# EAGLE schematic Type-C Test Fixture (TPS65987D)_v1 (EAGLE 9.6.1)
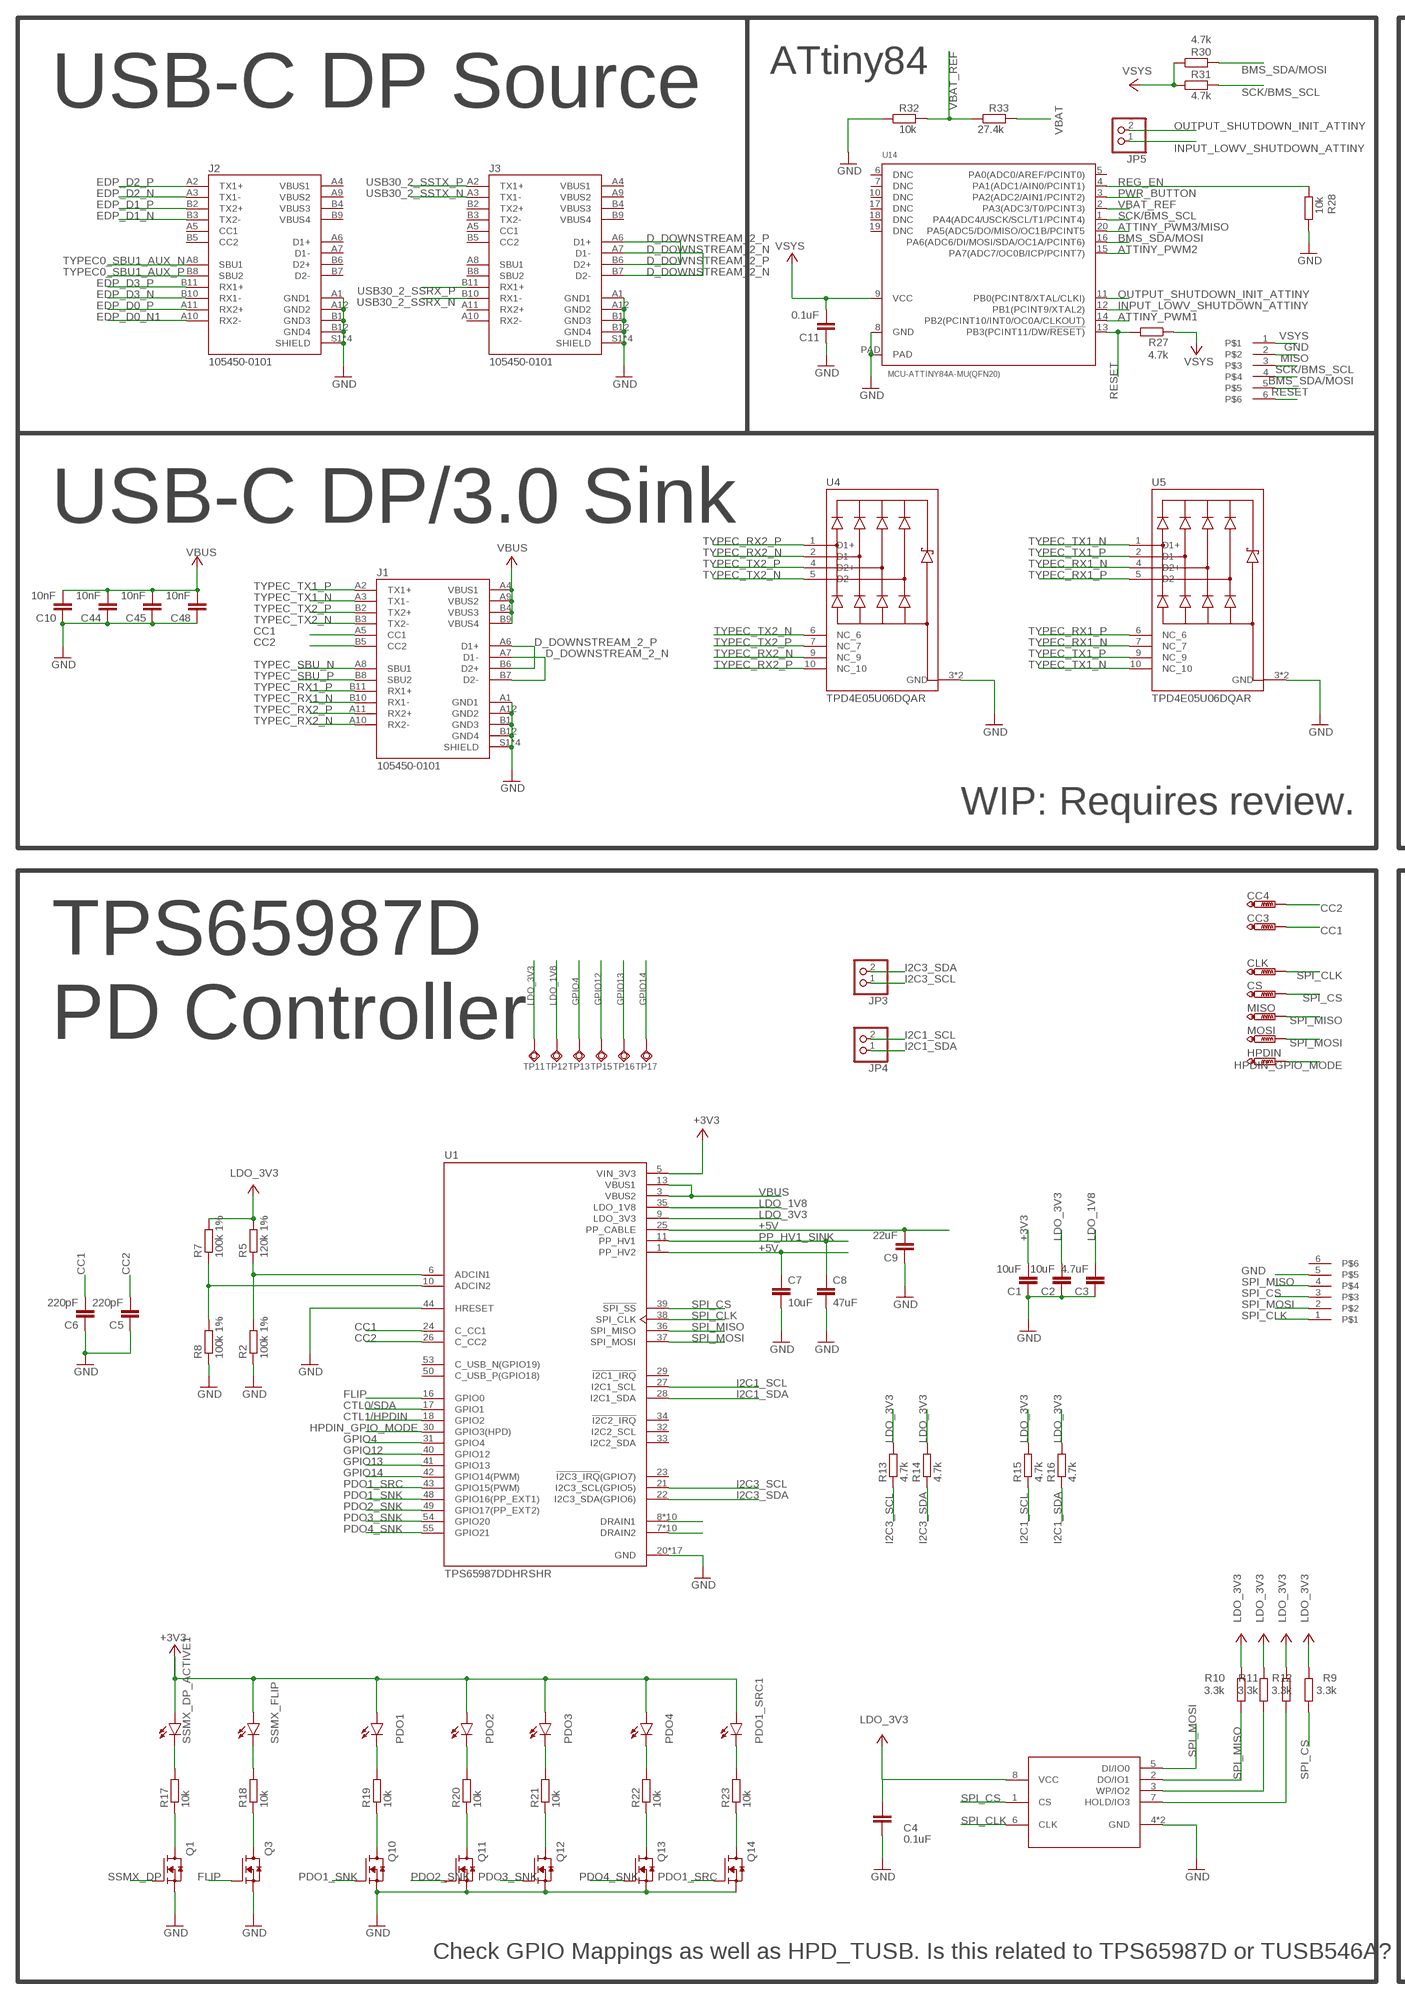
[diagram p0: schematic, sheet 1, part 1 of 2]
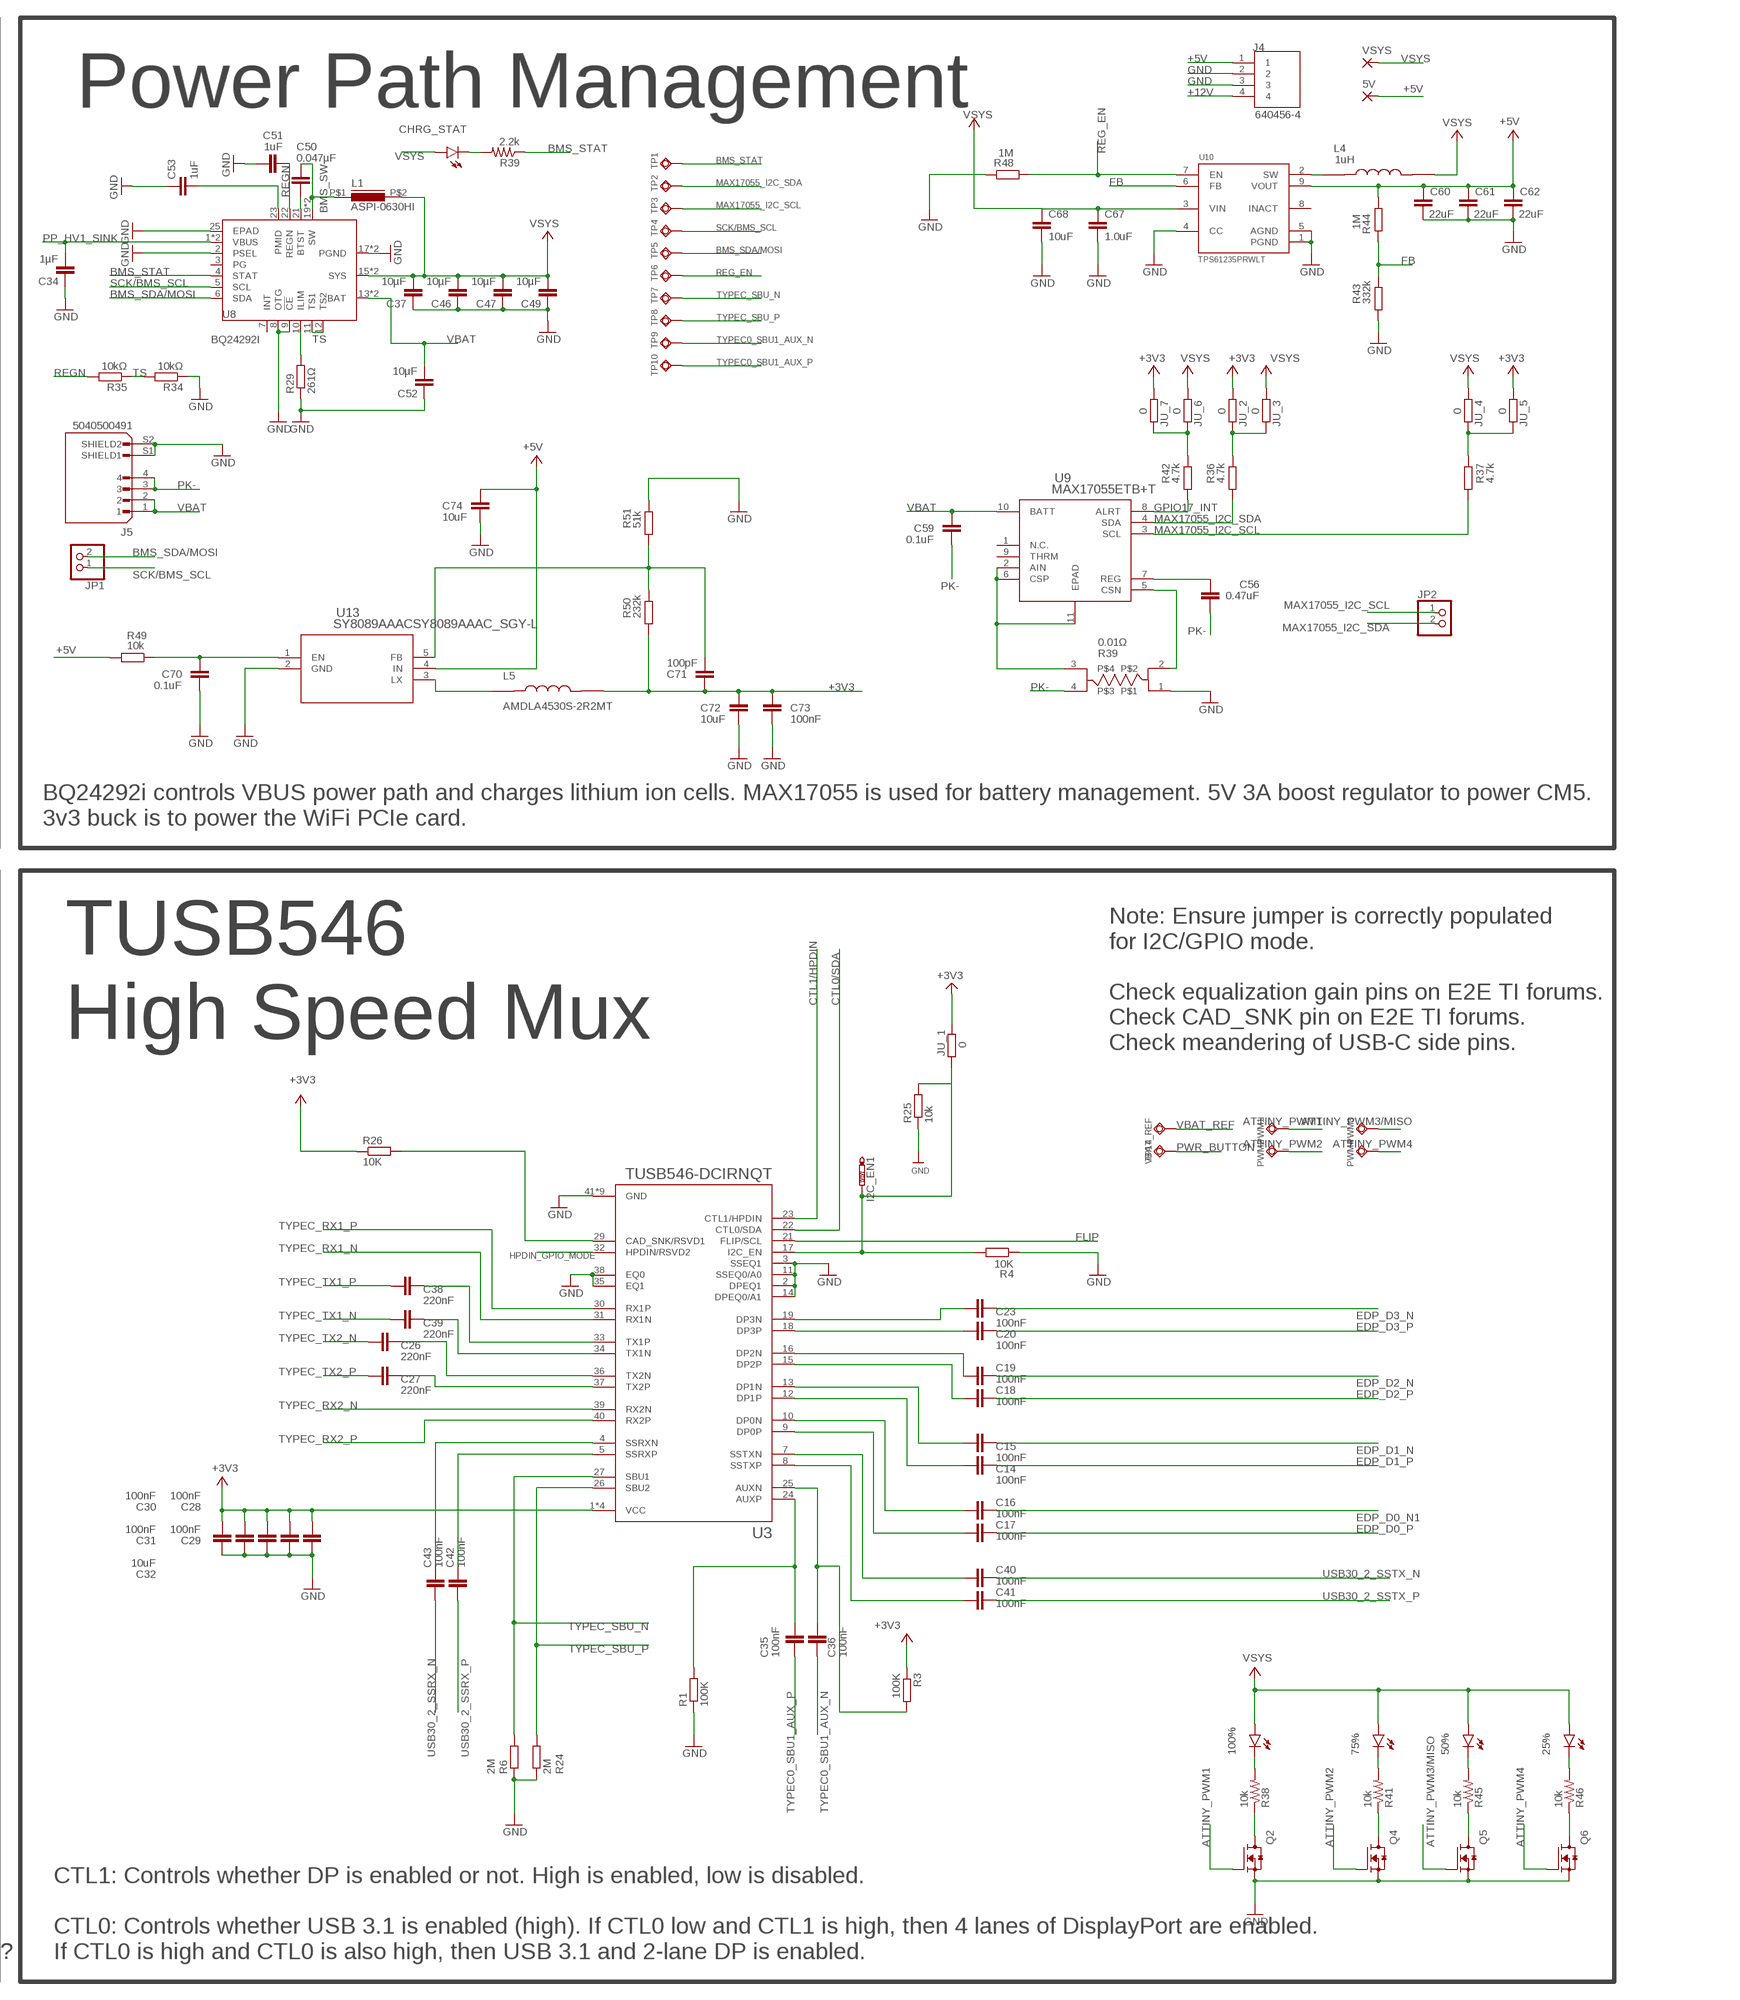
[diagram p1: schematic, sheet 1, part 2 of 2]

## Parts
5V  SMD5  [SMD2,54-5,08]
25%  LEDSML0603  [SML0603]
50%  LEDSML0603  [SML0603]
75%  LEDSML0603  [SML0603]
100%  LEDSML0603  [SML0603]
C1  10uF  C-EUC0402  [C0402]
C2  10uF  C-EUC0402  [C0402]
C3  4.7uF  C-EUC0402  [C0402]
C4  0.1uF  C-EUC0402  [C0402]
C5  220pF  C-EUC0402  [C0402]
C6  220pF  C-EUC0402  [C0402]
C7  10uF  C-EUC0402  [C0402]
C8  47uF  C-EUC0603  [C0603]
C9  22uF  C-EUC0402  [C0402]
C10  10nF  C-EUC0805  [C0805]
C11  0.1uF  C-EUC0402-YVELTAL  [C0402]
C14  100nF  C-EUC0402  [C0402]
C15  100nF  C-EUC0402  [C0402]
C16  100nF  C-EUC0402  [C0402]
C17  100nF  C-EUC0402  [C0402]
C18  100nF  C-EUC0402  [C0402]
C19  100nF  C-EUC0402  [C0402]
C20  100nF  C-EUC0402  [C0402]
C23  100nF  C-EUC0402  [C0402]
C26  220nF  C-EUC0402  [C0402]
C27  220nF  C-EUC0402  [C0402]
C28  100nF  C-EUC0402  [C0402]
C29  100nF  C-EUC0402  [C0402]
C30  100nF  C-EUC0402  [C0402]
C31  100nF  C-EUC0402  [C0402]
C32  10uF  C-EUC0805  [C0805]
C34  1µF  C-EUC0805  [C0805]
C35  100nF  C-EUC0402  [C0402]
C36  100nF  C-EUC0402  [C0402]
C37  10µF  C-EUC0805  [C0805]
C38  220nF  C-EUC0402  [C0402]
C39  220nF  C-EUC0402  [C0402]
C40  100nF  C-EUC0402  [C0402]
C41  100nF  C-EUC0402  [C0402]
C42  100nF  C-EUC0402  [C0402]
C43  100nF  C-EUC0402  [C0402]
C44  10nF  C-EUC0805  [C0805]
C45  10nF  C-EUC0805  [C0805]
C46  10µF  C-EUC0805  [C0805]
C47  10µF  C-EUC0805  [C0805]
C48  10nF  C-EUC0805  [C0805]
C49  10µF  C-EUC0805  [C0805]
C50  0.047µF  C-EUC0603  [C0603]
C51  1uF  C-EUC0603  [C0603]
C52  10µF  C-EUC0805  [C0805]
C53  1uF  C-EUC0603  [C0603]
C56  0.47uF  C-EUC0402-YVELTAL  [C0402]
C59  0.1uF  C-EUC0402-YVELTAL  [C0402]
C60  22uF  1.0UF-0805-25V-10%  [0805]
C61  22uF  1.0UF-0805-25V-10%  [0805]
C62  22uF  1.0UF-0805-25V-10%  [0805]
C67  1.0uF  1.0UF-0603-16V-10%  [0603]
C68  10uF  1.0UF-0603-16V-10%  [0603]
C70  0.1uF  C-EUC0402-YVELTAL  [C0402]
C71  100pF  C-EUC0402-YVELTAL  [C0402]
C72  10uF  C-EUC0402-YVELTAL  [C0402]
C73  100nF  C-EUC0402-YVELTAL  [C0402]
C74  10uF  C-EUC0402-YVELTAL  [C0402]
CC3  PTR1TP07R  [TP07R]
CC4  PTR1TP07R  [TP07R]
CHRG_STAT  LEDSML0603  [SML0603]
CLK  PTR1TP07R  [TP07R]
CS  PTR1TP07R  [TP07R]
HPDIN  PTR1TP07R  [TP07R]
I2C_EN1  PTR1TP07R  [TP07R]
J1  105450-0101  [MOLEX_105450-0101]
J2  105450-0101  [MOLEX_105450-0101]
J3  105450-0101  [MOLEX_105450-0101]
J4  640456-4  [TE_640456-4]
J5  5040500491  [MOLEX_5040500491]
JP1  PINHD-1X2  [1X02]
JP2  PINHD-1X2  [1X02]
JP3  PINHD-1X2  [1X02]
JP4  PINHD-1X2  [1X02]
JP5  PINHD-1X2  [1X02]
JU_1  0  R-EU_R0402  [R0402]
JU_2  0  R-EU_R0402  [R0402]
JU_3  0  R-EU_R0402  [R0402]
JU_4  0  R-EU_R0402  [R0402]
JU_5  0  R-EU_R0402  [R0402]
JU_6  0  R-EU_R0402  [R0402]
JU_7  0  R-EU_R0402  [R0402]
L1  ASPI-0630HI  [ASPI-0630HI]
L4  1uH  SPM5020T-1R0M  [IND_SPM5020T-1R0M]
L5  AMDLA4530S-2R2MT  [IND_AMDLA4530S-2R2MT]
MISO  PTR1TP07R  [TP07R]
MOSI  PTR1TP07R  [TP07R]
PDO1  LEDSML0603  [SML0603]
PDO1_SRC1  LEDSML0603  [SML0603]
PDO2  LEDSML0603  [SML0603]
PDO3  LEDSML0603  [SML0603]
PDO4  LEDSML0603  [SML0603]
PWM1  TPSQTP07R  [TP07R]
PWM2  TPSQTP07R  [TP07R]
PWM3  TPSQTP07R  [TP07R]
PWM4  TPSQTP07R  [TP07R]
Q1  AO3400A  [SOT95P280X125-3N]
Q2  AO3400A  [SOT95P280X125-3N]
Q3  AO3400A  [SOT95P280X125-3N]
Q4  AO3400A  [SOT95P280X125-3N]
Q5  AO3400A  [SOT95P280X125-3N]
Q6  AO3400A  [SOT95P280X125-3N]
Q10  AO3400A  [SOT95P280X125-3N]
Q11  AO3400A  [SOT95P280X125-3N]
Q12  AO3400A  [SOT95P280X125-3N]
Q13  AO3400A  [SOT95P280X125-3N]
Q14  AO3400A  [SOT95P280X125-3N]
R1  100K  R-EU_R0402  [R0402]
R2  100k 1%  R-EU_R0402  [R0402]
R3  100K  R-EU_R0402  [R0402]
R4  10K  R-EU_R0402  [R0402]
R5  120k 1%  R-EU_R0402  [R0402]
R6  2M  R-EU_R0402  [R0402]
R7  100k 1%  R-EU_R0402  [R0402]
R8  100k 1%  R-EU_R0402  [R0402]
R9  3.3k  R-EU_R0402  [R0402]
R10  3.3k  R-EU_R0402  [R0402]
R11  3.3k  R-EU_R0402  [R0402]
R12  3.3k  R-EU_R0402  [R0402]
R13  4.7k  R-EU_R0402  [R0402]
R14  4.7k  R-EU_R0402  [R0402]
R15  4.7k  R-EU_R0402  [R0402]
R16  4.7k  R-EU_R0402  [R0402]
R17  10k  R-EU_R0402  [R0402]
R18  10k  R-EU_R0402  [R0402]
R19  10k  R-EU_R0402  [R0402]
R20  10k  R-EU_R0402  [R0402]
R21  10k  R-EU_R0402  [R0402]
R22  10k  R-EU_R0402  [R0402]
R23  10k  R-EU_R0402  [R0402]
R24  2M  R-EU_R0402  [R0402]
R25  10k  R-EU_R0402  [R0402]
R26  10K  R-EU_R0402  [R0402]
R27  4.7k  R-EU_R0402  [R0402]
R28  10k  R-EU_R0402  [R0402]
R29  261Ω  R-EU_R0402  [R0402]
R30  4.7k  R-EU_R0402  [R0402]
R31  4.7k  R-EU_R0402  [R0402]
R32  10k  R-EU_R0402  [R0402]
R33  27.4k  R-EU_R0402  [R0402]
R34  10kΩ  R-EU_R0402  [R0402]
R35  10kΩ  R-EU_R0603  [R0603]
R36  4.7k  R-EU_R0402  [R0402]
R37  4.7k  R-EU_R0402  [R0402]
R38  10k  R-US_R0201  [R0201]
R39  2.2k  R-US_R0201  [R0201]
R40  PS0306DRF7T0R01L  [PS0306DRF7T0R01L]
R41  10k  R-US_R0201  [R0201]
R42  4.7k  R-EU_R0402  [R0402]
R43  332k  R-EU_R0402  [R0402]
R44  1M  R-EU_R0402  [R0402]
R45  10k  R-US_R0201  [R0201]
R46  10k  R-US_R0201  [R0201]
R48  1M  R-EU_R0402  [R0402]
R49  10k  R-EU_R0402  [R0402]
R50  232k  R-EU_R0402  [R0402]
R51  51k  R-EU_R0402  [R0402]
SSMX_DP_ACTIVE1  LEDSML0603  [SML0603]
SSMX_FLIP_ACTIVE1  SSMX_FLIP  LEDSML0603  [SML0603]
TP1  TPSQTP07R  [TP07R]
TP2  TPSQTP07R  [TP07R]
TP3  TPSQTP07R  [TP07R]
TP4  TPSQTP07R  [TP07R]
TP5  TPSQTP07R  [TP07R]
TP6  TPSQTP07R  [TP07R]
TP7  TPSQTP07R  [TP07R]
TP8  TPSQTP07R  [TP07R]
TP9  TPSQTP07R  [TP07R]
TP10  TPSQTP07R  [TP07R]
TP11  TPSQTP07R  [TP07R]
TP12  TPSQTP07R  [TP07R]
TP13  TPSQTP07R  [TP07R]
TP14  TPSQTP07R  [TP07R]
TP15  TPSQTP07R  [TP07R]
TP16  TPSQTP07R  [TP07R]
TP17  TPSQTP07R  [TP07R]
U1  TPS65987DDHRSHR  [IC_TPS65987DDHRSHR]
U2  W25X05CLUXIGTR  [PSON50P300X200X60-9N]
U3  TUSB546-DCIRNQT  [QFN40P400X600X80-41N]
U4  TPD4E05U06DQAR  [IC_TPD4E05U06DQAR]
U5  TPD4E05U06DQAR  [IC_TPD4E05U06DQAR]
U8  BQ24292I  [QFN50P400X400X100-25N]
U9  MAX17055ETB+T  [21-100013A_T102A2+1C_MXM]
U10  TPS61235PRWLT  [CONV_TPS61235PRWLT]
U13  SY8089AAACSY8089AAAC_SGY-L  [SY8089AAAC_SGY-L]
U14  MCU-ATTINY84A-MU(QFN20)  [QFN20G-0.5-4X4MM]
U$3  6PINEADER  [1MM_PIC-PROGRAMING_HEADER]
U$5  6PINEADER  [1MM_PIC-PROGRAMING_HEADER]
VBAT_REF  TPSQTP07R  [TP07R]
VSYS  SMD5  [SMD2,54-5,08]

## Nets
+3V3: C1.2 C28.2 C29.2 C30.2 C31.2 C32.2 C71.1 C72.1 C73.1 JU_1.2 JU_2.1 JU_5.1 JU_7.1 L5.2 PDO1.A PDO1_SRC1.A PDO2.A PDO3.A PDO4.A R3.1 R26.1 R50.2 SSMX_DP_ACTIVE1.A SSMX_FLIP_ACTIVE1.A U1.5(VIN_3V3) U3.1(VCC) U3.6(VCC) U3.20(VCC) U3.28(VCC) ; supply symbol labelled VCC, VDDIO, VSYS
+5V: 5V.1(P) C7.1 C9.2 C60.1 C61.1 C62.1 C74.1 J4.1 R44.2 R49.2 U1.1(PP_HV2) U1.25(PP_CABLE) U10.9(VOUT) U13.4(IN) ; supply symbol labelled VSYS
+12V: J4.4
ATTINY_PWM1: PWM1.TP Q2.1(G) U14.14(PB2(PCINT10/INT0/OC0A/CLKOUT))
ATTINY_PWM2: PWM2.TP Q4.1(G) U14.15(PA7(ADC7/OC0B/ICP/PCINT7))
ATTINY_PWM3/MISO: PWM3.TP Q5.1(G) U14.20(PA5(ADC5/DO/MISO/OC1B/PCINT5)
ATTINY_PWM4: PWM4.TP Q6.1(G)
BMS_SDA/MOSI: JP1.2 R30.2 TP5.TP U8.6(SDA) U14.16(PA6(ADC6/DI/MOSI/SDA/OC1A/PCINT6)) U$5.5
BMS_STAT: R39.1 TP1.TP U8.4(STAT)
BMS_SW: C50.1 L1.P$1 U8.19(SW) U8.20(SW)
CC1: C6.2 CC3.TP J1.A5(CC1) U1.24(C_CC1)
CC2: C5.2 CC4.TP J1.B5(CC2) U1.26(C_CC2)
CTL0/SDA: U1.17(GPIO1) U3.22(CTL0/SDA)
CTL1/HPDIN: U1.18(GPIO2) U3.23(CTL1/HPDIN)
D_DOWNSTREAM_2_N [USB 1st Layer]: J1.A7(D1-) J1.B7(D2-) J3.A7(D1-) J3.B7(D2-)
D_DOWNSTREAM_2_P [USB 1st Layer]: J1.A6(D1+) J1.B6(D2+) J3.A6(D1+) J3.B6(D2+)
EDP_D0_N1 [eDP 1st Layer]: C16.1 C16.2 J2.A10(RX2-) U3.10(DP0N)
EDP_D0_P [eDP 1st Layer]: C17.1 C17.2 J2.A11(RX2+) U3.9(DP0P)
EDP_D1_N [eDP 1st Layer]: C15.1 C15.2 J2.B3(TX2-) U3.13(DP1N)
EDP_D1_P [eDP 1st Layer]: C14.1 C14.2 J2.B2(TX2+) U3.12(DP1P)
EDP_D2_N [eDP 1st Layer]: C19.1 C19.2 J2.A3(TX1-) U3.16(DP2N)
EDP_D2_P [eDP 1st Layer]: C18.1 C18.2 J2.A2(TX1+) U3.15(DP2P)
EDP_D3_N [eDP 1st Layer]: C23.1 C23.2 J2.B10(RX1-) U3.19(DP3N)
EDP_D3_P [eDP 1st Layer]: C20.1 C20.2 J2.B11(RX1+) U3.18(DP3P)
FB: R43.1 R44.1 U10.6(FB)
FLIP: Q3.1(G) U1.16(GPIO0) U3.21(FLIP/SCL)
GND: C1.1 C2.1 C3.1 C4.1 C5.1 C6.1 C7.2 C8.2 C9.1 C10.1 C11.1 C28.1 C29.1 C30.1 C31.1 C32.1 C34.1 C37.1 C44.1 C45.1 C46.1 C47.1 C48.1 C49.1 C51.1 C52.1 C53.1 C60.2 C61.2 C62.2 C67.2 C68.2 C70.2 C72.2 C73.2 C74.2 J1.A1(GND1) J1.A12(GND2) J1.B1(GND3) J1.B12(GND4) J1.S1(SHIELD) J1.S2(SHIELD) J1.S3(SHIELD) J1.S4(SHIELD) J2.A1(GND1) J2.A12(GND2) J2.B1(GND3) J2.B12(GND4) J2.S1(SHIELD) J2.S2(SHIELD) J2.S3(SHIELD) J2.S4(SHIELD) J3.A1(GND1) J3.A12(GND2) J3.B1(GND3) J3.B12(GND4) J3.S1(SHIELD) J3.S2(SHIELD) J3.S3(SHIELD) J3.S4(SHIELD) J4.2 J4.3 J5.S1(SHIELD1) J5.S2(SHIELD2) Q1.2(S) Q2.2(S) Q3.2(S) Q4.2(S) Q5.2(S) Q6.2(S) Q10.2(S) Q11.2(S) Q12.2(S) Q13.2(S) Q14.2(S) R1.1 R2.1 R4.1 R6.1 R8.1 R24.1 R25.1 R28.1 R29.1 R32.1 R34.1 R40.1 R43.2 R48.1 R51.1 U1.20(GND) U1.44(HRESET) U1.45(GND) U1.46(GND) U1.47(GND) U1.51(GND) U1.59(GND) U1.59_1(GND) U1.59_2(GND) U1.59_3(GND) U1.59_4(GND) U1.59_5(GND) U1.59_6(GND) U1.59_7(GND) U1.59_8(GND) U1.59_9(GND) U1.59_10(GND) U1.59_11(GND) U2.4(GND) U2.9(GND) U3.2(DPEQ1) U3.3(SSEQ1) U3.11(SSEQ0/A0) U3.14(DPEQ0/A1) U3.35(EQ1) U3.38(EQ0) U3.41(GND) U3.42(GND) U3.43(GND) U3.44(GND) U3.45(GND) U3.46(GND) U3.47(GND) U3.48(GND) U3.49(GND) U4.3(GND) U4.8(GND) U5.3(GND) U5.8(GND) U8.2(PSEL) U8.8(OTG) U8.9(!CE) U8.17(PGND) U8.18(PGND) U8.25(EPAD) U10.1(PGND) U10.4(CC) U10.5(AGND) U13.2(GND) U14.8(GND) U14.PAD U$3.5 U$5.2
GPIO4: TP13.TP U1.31(GPIO4)
GPIO12: TP15.TP U1.40(GPIO12)
GPIO13: TP16.TP U1.41(GPIO13)
GPIO14: TP17.TP U1.42(GPIO14(PWM))
GPIO17_INT: R42.2 U9.8(ALRT)
HPDIN_GPIO_MODE: HPDIN.TP U1.30(GPIO3(HPD)) U3.32(HPDIN/RSVD2)
I2C1_SCL: JP4.2 R15.1 U1.27(I2C1_SCL)
I2C1_SDA: JP4.1 R16.1 U1.28(I2C1_SDA)
I2C3_SCL: JP3.1 R13.1 U1.21(I2C3_SCL(GPIO5))
I2C3_SDA: JP3.2 R14.1 U1.22(I2C3_SDA(GPIO6))
INPUT_LOWV_SHUTDOWN_ATTINY: JP5.1 U14.12(PB1(PCINT9/XTAL2))
LDO_1V8: C3.2 TP12.TP U1.35(LDO_1V8)
LDO_3V3: C2.2 C4.2 R5.2 R7.2 R9.2 R10.2 R11.2 R12.2 R13.2 R14.2 R15.2 R16.2 TP11.TP U1.9(LDO_3V3) U2.8(VCC) ; supply symbol labelled VCC
MAX17055_I2C_SCL: JP2.1 R37.2 TP3.TP U9.3(SCL)
MAX17055_I2C_SDA: JP2.2 R36.2 TP2.TP U9.4(SDA)
MISO: U$5.3
N$1: R2.2 R5.1 U1.6(ADCIN1)
N$2: I2C_EN1.TP JU_1.1 R4.2 R25.2 U3.17(I2C_EN)
N$3: R7.1 R8.2 U1.10(ADCIN2)
N$4: R26.2 U3.29(CAD_SNK/RSVD1)
N$5: JU_6.2 JU_7.2 R42.1
N$6: JU_2.2 JU_3.2 R36.1
N$7: JU_4.2 JU_5.2 R37.1
N$9: C50.2 U8.21(BTST)
N$10: U1.8(DRAIN1) U1.15(DRAIN1) U1.19(DRAIN1) U1.58(DRAIN1) U1.58_1(DRAIN1) U1.58_2(DRAIN1) U1.58_3(DRAIN1) U1.58_4(DRAIN1) U1.58_5(DRAIN1) U1.58_6(DRAIN1)
N$11: R29.2 U8.10(ILIM)
N$12: C53.2 U8.23(PMID)
N$13: U1.7(DRAIN2) U1.52(DRAIN2) U1.56(DRAIN2) U1.57(DRAIN2) U1.57_1(DRAIN2) U1.57_2(DRAIN2) U1.57_3(DRAIN2) U1.57_4(DRAIN2) U1.57_5(DRAIN2) U1.57_6(DRAIN2)
N$14: R11.1 U2.3(WP/IO2)
N$15: R12.1 U2.7(HOLD/IO3)
N$16: R17.2 SSMX_DP_ACTIVE1.C
N$17: R18.2 SSMX_FLIP_ACTIVE1.C
N$18: Q1.3(D) R17.1
N$19: L4.1 U10.2(SW)
N$20: Q3.3(D) R18.1
N$21: PDO1.C R19.2
N$22: PDO2.C R20.2
N$23: PDO3.C R21.2
N$24: PDO4.C R22.2
N$25: PDO1_SRC1.C R23.2
N$26: Q14.3(D) R23.1
N$27: Q13.3(D) R22.1
N$28: Q12.3(D) R21.1
N$29: Q10.3(D) R19.1
N$30: Q11.3(D) R20.1
N$35: C56.1 U9.7(REG)
N$36: R40.2 U9.5(CSN)
N$37: R40.3 U9.2(AIN) U9.6(CSP) U9.11(EPAD)
N$38: C70.1 R49.1 U13.1(EN)
N$39: L5.1 U13.3(LX)
N$40: C71.2 R50.1 R51.2 U13.5(FB)
N$54_N [USB 1st Layer]: C36.2 R3.2 U3.25(AUXN)
N$54_P [USB 1st Layer]: C35.2 R1.2 U3.24(AUXP)
N$56: CHRG_STAT.C R39.2
N$59: 100%.C R38.2
N$60: 75%.C R41.2
N$61: 50%.C R45.2
N$62: 25%.C R46.2
N$63: Q2.3(D) R38.1
N$64: Q4.3(D) R41.1
N$65: Q5.3(D) R45.1
N$66: Q6.3(D) R46.1
OUTPUT_SHUTDOWN_INIT_ATTINY: JP5.2 U14.11(PB0(PCINT8/XTAL/CLKI))
PDO1_SNK: Q10.1(G) U1.48(GPIO16(PP_EXT1))
PDO1_SRC: Q14.1(G) U1.43(GPIO15(PWM))
PDO2_SNK: Q11.1(G) U1.49(GPIO17(PP_EXT2))
PDO3_SNK: Q12.1(G) U1.54(GPIO20)
PDO4_SNK: Q13.1(G) U1.55(GPIO21)
PK-: C56.2 C59.2 J5.3 J5.4 R40.4
PP_HV1_SINK: C8.1 C34.2 U1.11(PP_HV1) U8.1(VBUS) U8.24(VBUS)
PWR_BUTTON: TP14.TP U14.3(PA2(ADC2/AIN1/PCINT2))
REG_EN: R28.2 R48.2 TP6.TP U10.7(EN) U14.4(PA1(ADC1/AIN0/PCINT1))
REGN: C51.2 R35.2 U8.22(REGN)
RESET: R27.2 U14.13(PB3(PCINT11/DW/!RESET)) U$5.6
SCK/BMS_SCL: JP1.1 R31.2 TP4.TP U8.5(SCL) U14.1(PA4(ADC4/USCK/SCL/T1/PCINT4)) U$5.4
SPI_CLK: CLK.TP U1.38(SPI_CLK) U2.6(CLK) U$3.1
SPI_CS: CS.TP R9.1 U1.39(!SPI_SS) U2.1(CS) U$3.3
SPI_MISO: MISO.TP R10.1 U1.36(SPI_MISO) U2.2(DO/IO1) U$3.4
SPI_MOSI: MOSI.TP U1.37(SPI_MOSI) U2.5(DI/IO0) U$3.2
SSMX_DP: Q1.1(G)
TS: R34.2 R35.1 U8.11(TS1) U8.12(TS2)
TYPEC0_SBU1_AUX_N [eDP 1st Layer]: C36.1 J2.A8(SBU1) TP9.TP
TYPEC0_SBU1_AUX_P [eDP 1st Layer]: C35.1 J2.B8(SBU2) TP10.TP
TYPEC_RX1_N [eDP 1st Layer]: J1.B10(RX1-) U3.31(RX1N) U5.4(D2+) U5.7(NC_7)
TYPEC_RX1_P [eDP 1st Layer]: J1.B11(RX1+) U3.30(RX1P) U5.5(D2-) U5.6(NC_6)
TYPEC_RX2_N [eDP 1st Layer]: J1.A10(RX2-) U3.39(RX2N) U4.2(D1-) U4.9(NC_9)
TYPEC_RX2_P [eDP 1st Layer]: J1.A11(RX2+) U3.40(RX2P) U4.1(D1+) U4.10(NC_10)
TYPEC_SBU_N: J1.A8(SBU1) R6.2 TP7.TP U3.27(SBU1)
TYPEC_SBU_P: J1.B8(SBU2) R24.2 TP8.TP U3.26(SBU2)
TYPEC_TX1_N [eDP 1st Layer]: C39.1 C39.2 J1.A3(TX1-) U3.34(TX1N) U5.1(D1+) U5.10(NC_10)
TYPEC_TX1_P [eDP 1st Layer]: C38.1 C38.2 J1.A2(TX1+) U3.33(TX1P) U5.2(D1-) U5.9(NC_9)
TYPEC_TX2_N [eDP 1st Layer]: C26.1 C26.2 J1.B3(TX2-) U3.36(TX2N) U4.5(D2-) U4.6(NC_6)
TYPEC_TX2_P [eDP 1st Layer]: C27.1 C27.2 J1.B2(TX2+) U3.37(TX2P) U4.4(D2+) U4.7(NC_7)
USB30_2_SSRX_N [USB 1st Layer]: C43.1 C43.2 J3.B10(RX1-) U3.4(SSRXN)
USB30_2_SSRX_P [USB 1st Layer]: C42.1 C42.2 J3.B11(RX1+) U3.5(SSRXP)
USB30_2_SSTX_N [USB 1st Layer]: C40.1 C40.2 J3.A3(TX1-) U3.7(SSTXN)
USB30_2_SSTX_P [USB 1st Layer]: C41.1 C41.2 J3.A2(TX1+) U3.8(SSTXP)
VBAT: C52.2 C59.1 J5.1 J5.2 R33.2 U8.13(BAT) U8.14(BAT) U9.10(BATT)
VBAT_REF: R32.2 R33.1 U14.2(PA3(ADC3/T0/PCINT3)) VBAT_REF.TP
VBUS: C10.2 C44.2 C45.2 C48.2 J1.A4(VBUS1) J1.A9(VBUS2) J1.B4(VBUS3) J1.B9(VBUS4) U1.3(VBUS2) U1.13(VBUS1) ; supply symbol labelled VCC
VSYS: 25%.A 50%.A 75%.A 100%.A C11.2 C37.2 C46.2 C47.2 C49.2 C67.1 C68.1 CHRG_STAT.A JU_3.1 JU_4.1 JU_6.1 L1.P$2 L4.2 R27.1 R30.1 R31.1 U8.15(SYS) U8.16(SYS) U10.3(VIN) U14.9(VCC) U$5.1 VSYS.1(P) ; supply symbol labelled VCC
Unconnected: J2.A4(VBUS1) J2.A5(CC1) J2.A6(D1+) J2.A7(D1-) J2.A9(VBUS2) J2.B4(VBUS3) J2.B5(CC2) J2.B6(D2+) J2.B7(D2-) J2.B9(VBUS4) J3.A4(VBUS1) J3.A5(CC1) J3.A8(SBU1) J3.A9(VBUS2) J3.A10(RX2-) J3.A11(RX2+) J3.B2(TX2+) J3.B3(TX2-) J3.B4(VBUS3) J3.B5(CC2) J3.B8(SBU2) J3.B9(VBUS4) U1.23(!I2C3_IRQ!(GPIO7)) U1.29(!I2C1_IRQ) U1.32(I2C2_SCL) U1.33(I2C2_SDA) U1.34(!I2C2_IRQ) U1.50(C_USB_P(GPIO18)) U1.53(C_USB_N(GPIO19)) U8.3(PG) U8.7(INT) U9.1(N.C.) U9.9(THRM) U10.8(INACT) U14.5(PA0(ADC0/AREF/PCINT0)) U14.6(DNC) U14.7(DNC) U14.10(DNC) U14.17(DNC) U14.18(DNC) U14.19(DNC) U$3.6

## Notes on the sheet
- ATtiny84
- USB-C DP Source | Power Path Management
- USB-C DP/3.0 Sink
- 0.01Ω
- R39
- WIP: Requires review.
- BQ24292i controls VBUS power path and charges lithium ion cells. MAX17055 is used for battery management. 5V 3A boost regulator to power CM5. 
  3v3 buck is to power the WiFi PCIe card.
- TPS65987D
  PD Controller
- TUSB546
  High Speed Mux
- Note: Ensure jumper is correctly populated
  for I2C/GPIO mode.
  
  Check equalization gain pins on E2E TI forums. 
  Check CAD_SNK pin on E2E TI forums.
  Check meandering of USB-C side pins.
- Check GPIO Mappings as well as HPD_TUSB. Is this related to TPS65987D or TUSB546A?
- CTL1: Controls whether DP is enabled or not. High is enabled, low is disabled. 
  
  CTL0: Controls whether USB 3.1 is enabled (high). If CTL0 low and CTL1 is high, then 4 lanes of DisplayPort are enabled. 
  If CTL0 is high and CTL0 is also high, then USB 3.1 and 2-lane DP is enabled.

## Library data of the parts
5V VSYS = wirepad:SMD5: SMD PAD
25% 50% 75% 100% CHRG_STAT PDO1 PDO1_SRC1 PDO2-PDO4 SSMX_DP_ACTIVE1 SSMX_FLIP_ACTIVE1 = led:LED: LED OSRAM: - CHIPLED LG R971, LG N971, LY N971, LG Q971, LY Q971, LO R971, LY R971 LH N974, LH R974 LS Q976, LO Q976, LY Q976 LO Q996 - Hyper CHIPLED LW Q18S LB Q993, LB Q99A, LB R99A - SideLED LS A670, LO A670, LY A670, LG A670, LP A670 LB A673, LV A673, LT A673, LW A673 LH A674 LY A675 LS A676, LA A676, LO A676, LY A676, LW A676 LS A679, LY A679, LG A679 - Hyper Micro SIDELED® LS Y876, LA Y876, LO Y876, LY Y876 LT Y87S - SmartLED LW L88C, LW L88S LB L89C, LB L89S, LG L890 LS L89K, LO L89K, LY L89K LS L896, LA L896, LO L896, LY L896 - TOPLED LS T670, LO T670, LY T670, LG T670, LP T670 LSG T670, LSP T670, LSY T670, LOP T670, LYG T670 LG T671, LOG T671, LSG T671 LB T673, LV T673, LT T673, LW T673 LH T674 LS T676, LA T676, LO T676, LY T676, LB T676, LH T676, LSB T676, LW T676 LB T67C, LV T67C, LT T67C, LS T67K, LO T67K, LY T67K, LW E67C LS E67B, LA E67B, LO E67B, LY E67B, LB E67C, LV E67C, LT E67C LW T67C LS T679, LY T679, LG T679 LS T770, LO T770, LY T770, LG T770, LP T770 LB T773, LV T773, LT T773, LW T773 LH T774 LS E675, LA E675, LY E675, LS T675 LS T776, LA T776, LO T776, LY T776, LB T776 LHGB T686 LT T68C, LB T68C - Hyper Mini TOPLED® LB M676 - Mini TOPLED Santana® LG M470 LS M47K, LO M47K, LY M47K Source: http://www.osram.convergy.de LUXEON: - LUMILED® LXK2-PW12-R00, LXK2-PW12-S00, LXK2-PW14-U00, LXK2-PW14-V00 LXK2-PM12-R00, LXK2-PM12-S00, LXK2-PM14-U00 LXK2-PE12-Q00, LXK2-PE12-R00, LXK2-PE12-S00, LXK2-PE14-T00, LXK2-PE14-U00 LXK2-PB12-K00, LXK2-PB12-L00, LXK2-PB12-M00, LXK2-PB14-N00, LXK2-PB14-P00, LXK2-PB14-Q00 LXK2-PR12-L00, LXK2-PR12-M00, LXK2-PR14-Q00, LXK2-PR14-R00 LXK2-PD12-Q00, LXK2-PD12-R00, LXK2-PD12-S00 LXK2-PH12-R00, LXK2-PH12-S00 LXK2-PL12-P00, LXK2-PL12-Q00, LXK2-PL12-R00 Source: www.luxeon.com KINGBRIGHT: KA-3528ASYC Source: www.kingbright.com
C1-C9 C14-C20 C23 C26-C31 C35 C36 C38-C43 = resistor@1:C-EU: CAPACITOR, European symbol
C10 C34 C37 C44-C50 C52 = resistor:C-EU: CAPACITOR, European symbol
C11 = rcl:C-EU: CAPACITOR, European symbol
C32 C51 C53 = rcl:C-EU: CAPACITOR, European symbol; SPICEPREFIX: C
C56 C59 C70-C74 = rcl@1:C-EU: CAPACITOR, European symbol
C60-C62 = SparkFun-Capacitors:1.0UF: 1µF ceramic capacitors A capacitor is a passive two-terminal electrical component used to store electrical energy temporarily in an electric field.; PROD_ID: CAP-08064; VALUE: 1.0uF
C67 = SparkFun-Capacitors:1.0UF: 1µF ceramic capacitors A capacitor is a passive two-terminal electrical component used to store electrical energy temporarily in an electric field.; PROD_ID: CAP-00868
C68 = SparkFun-Capacitors:1.0UF: 1µF ceramic capacitors A capacitor is a passive two-terminal electrical component used to store electrical energy temporarily in an electric field.; PROD_ID: CAP-00868; VALUE: 1.0uF
CC3 CC4 CLK CS HPDIN I2C_EN1 MISO MOSI = testpad:PTR1: TEST PIN
J1-J3 = 105450-0101:105450-0101: USB Shielded I/O Receptacle; Type C; Right Angle; Surface Mount; Gold over Nickel Check availability <https://pricing.snapeda.com/parts/105450-0101/Molex/view-part?ref=eda>; AVAILABILITY: In Stock; DESCRIPTION: USB-C (USB TYPE-C) USB 3.2 Gen 2 (USB 3.1 Gen 2, Superspeed + (USB 3.1)) Receptacle Connector 24 Position Surface Mount, Right Angle; Through Hole; MF: Molex; MP: 105450-0101; PACKAGE: None; PRICE: None; PURCHASE-URL: https://pricing.snapeda.com/search/part/105450-0101/?ref=eda
J4 = 640456-4:640456-4: 220P MTA100 HDR ASSY SQ SPCL Check availability <https://pricing.snapeda.com/parts/640456-4/TE%20Connectivity/view-part?ref=eda>; AVAILABILITY: In Stock; CENTERLINE_PITCH: 2.54 mm[.1 in]; CHECK_PRICES: https://www.snapeda.com/parts/640456-4/TE+Connectivity+AMP+Connectors/view-part/?ref=eda; COMMENT: 640456-4; DESCRIPTION: Header Friction Lock MTA-100 4 250 VAC Polyester Tin Copper Alloy Tin | TE Connectivity 640456-4; EU_ROHS_COMPLIANCE: Compliant; MF: TE Connectivity; MP: 640456-4; NUMBER_OF_POSITIONS: 4; PACKAGE: None; PRICE: None; PRODUCT_TYPE: Connector; PURCHASE-URL: https://www.snapeda.com/api/url_track_click_mouser/?unipart_id=567584&manufacturer=TE Connectivity&part_name=640456-4&search_term=te 640456-4; SNAPEDA_LINK: https://www.snapeda.com/parts/640456-4/TE+Connectivity+AMP+Connectors/view-part/?ref=snap
J5 = 5040500491:5040500491: Check availability <https://pricing.snapeda.com/parts/5040500491/Molex/view-part?ref=eda>; AVAILABILITY: In Stock; CHECK_PRICES: https://www.snapeda.com/parts/5040500491/Molex/view-part/?ref=eda; DESCRIPTION: Connector Header Surface Mount, Right Angle 4 position 0.059 (1.50mm); MF: Molex; MP: 5040500491; PACKAGE: None; PRICE: None; PURCHASE-URL: https://www.snapeda.com/api/url_track_click_mouser/?unipart_id=2346854&manufacturer=Molex&part_name=5040500491&search_term=5040500491; SNAPEDA_LINK: https://www.snapeda.com/parts/5040500491/Molex/view-part/?ref=snap
JP1-JP5 = pinhead:PINHD-1X2: PIN HEADER
JU_1-JU_7 R1-R4 R6-R28 R30-R33 R36 R37 R42-R44 R48-R51 = rcl:R-EU_: RESISTOR, European symbol; SPICEPREFIX: R
L1 = LCD Driver:ASPI-0630HI
L4 = SPM5020T-1R0M:SPM5020T-1R0M: Check availability <https://pricing.snapeda.com/parts/SPM5020T-1R0M/TDK/view-part?ref=eda>; AVAILABILITY: In Stock; DESCRIPTION: SPM Series 5.4 x 5.1 mm 1 uH ±20 % Tol. 6 A Shielded Wirewound Power Inductor; MF: TDK; MP: SPM5020T-1R0M; PACKAGE: NON STANDARD-2 TDK; PRICE: None; PURCHASE-URL: https://pricing.snapeda.com/search/part/SPM5020T-1R0M/?ref=eda
L5 = AMDLA4530S-2R2MT:AMDLA4530S-2R2MT: Check availability <https://pricing.snapeda.com/parts/AMDLA4530S-2R2MT/Abracon%20LLC/view-part?ref=eda>; AVAILABILITY: In Stock; DESCRIPTION: 2.2 µH Shielded Molded Inductor 6 A 27.6mOhm Max Nonstandard -; MF: Abracon LLC; MP: AMDLA4530S-2R2MT; PACKAGE: Package; PRICE: None; PURCHASE-URL: https://pricing.snapeda.com/search?q=AMDLA4530S-2R2MT&ref=eda
PWM1-PWM4 TP1-TP17 VBAT_REF = testpad:TPSQ: Test pad
Q1-Q6 Q10-Q14 = AO3400A:AO3400A: Trans MOSFET N-CH 30V 5.7A 3-Pin SOT-23; DESCRIPTION: N-Channel 30V 5.7A (Ta) 1.4W (Ta) Surface Mount SOT-23-3L; DIGI-KEY_PART_NUMBER: 785-1000-1-ND; MF: Alpha &; MP: AO3400A; PACKAGE: SOT-23 Alpha &amp; Omega Semiconductor
R5 = resistor@1:R-EU_: RESISTOR, European symbol
R29 R34 = rcl@1:R-EU_: RESISTOR, European symbol; SPICEPREFIX: R
R35 = resistor:R-EU_: RESISTOR, European symbol
R38 R39 R41 R45 R46 = rcl:R-US_: RESISTOR, American symbol; SPICEPREFIX: R
R40 = 12401598E4_2A:PS0306DRF7T0R01L
U1 = TPS65987DDHRSHR:TPS65987DDHRSHR: USB Type-C™ and USB PD Controller With Integrated Power Switches 56-VQFN -40 to 85 Check availability <https://pricing.snapeda.com/parts/TPS65987DDHRSHR/Texas%20Instruments/view-part?ref=eda>; AVAILABILITY: In Stock; DESCRIPTION: USB Type-C and USB PD controller with integrated power switches 56-VQFN -10 to 75; MF: Texas Instruments; MP: TPS65987DDHRSHR; PACKAGE: VQFN-56 Texas Instruments; PRICE: None; PURCHASE-URL: https://pricing.snapeda.com/search/part/TPS65987DDHRSHR/?ref=eda
U2 = PSON50P300X200X60-9N:W25X05CLUXIGTR
U3 = TUSB546-DCIRNQT:TUSB546-DCIRNQT: Buffer, ReDriver 2 Channel 8.1Gbps 40-WQFN (4x6) Check availability <https://pricing.snapeda.com/parts/TUSB546-DCIRNQT/Texas%20Instruments/view-part?ref=eda>; AVAILABILITY: In Stock; DESCRIPTION: USB Type-C DP ALT Mode Linear Redriver Crosspoint Switch 40-WQFN 0 to 70; MF: Texas Instruments; MP: TUSB546-DCIRNQT; PACKAGE: WQFN-40 Texas Instruments; PRICE: None; PURCHASE-URL: https://pricing.snapeda.com/search/part/TUSB546-DCIRNQT/?ref=eda
U4 U5 = TPD4E05U06DQAR:TPD4E05U06DQAR; DESCRIPTION: Quad 0.5-pF, 5.5-V, ±12-kV ESD protection diode for USB, HDMI & High Speed Interfaces; DIGI-KEY_PART_NUMBER: 296-35765-2-ND; MF: Texas Instruments; MP: TPD4E05U06DQAR; PACKAGE: USON-10 Texas Instruments; PURCHASE-URL: https://pricing.snapeda.com/search?q=TPD4E05U06DQAR&ref=eda
U8 = samacsys:BQ24292I
U9 = My_Stuff:MAX17055ETB+T; BUILT_BY: EMA_UL_Team; COPYRIGHT: Copyright (C) 2018 Accelerated Designs. All rights reserved; MANUFACTURER_PART_NUMBER: MAX17055ETB+T; REVISION: 1; SOURCELIBRARY: Maxim_2018-11-30; VENDOR: Maxim Integrated Products
U10 = TPS61235PRWLT:TPS61235PRWLT: TPS6123x 8-A Valley Current Synchronous Boost Converters with Constant Current Output Feature 9-VQFN-HR -40 to 85 Check availability <https://pricing.snapeda.com/parts/TPS61235PRWLT/Texas%20Instruments/view-part?ref=eda>; AVAILABILITY: In Stock; DESCRIPTION: 8-A valley current, 5.1-V fixed output voltage synchronous boost converters; MF: Texas Instruments; MP: TPS61235PRWLT; PACKAGE: VQFN-HR-9 Texas Instruments; PRICE: None; PURCHASE-URL: https://pricing.snapeda.com/search/part/TPS61235PRWLT/?ref=eda
U13 = SY8089AAAC:SY8089AAAC; COPYRIGHT: Copyright (C) 2023 Ultra Librarian. All rights reserved.; MANUFACTURER_PART_NUMBER: SY8089AAAC; MFR_NAME: Silergy
U14 = MCU-ATTINY84A-MU_QFN20_:MCU-ATTINY84A-MU(QFN20): 310010131 Check prices <https://pricing.snapeda.com/parts/ATTINY84A-MU/Microchip%20Technology/view-part?ref=eda>; AVAILABILITY: Good; DESCRIPTION: AVR AVR® ATtiny Microcontroller IC 8-Bit 20MHz 8KB (4K x 16) FLASH 20-QFN-EP (4x4); MF: Microchip Technology; MP: ATTINY84A-MU; PACKAGE: WFQFN-20 Microchip; PRICE: None; PURCHASE-URL: https://pricing.snapeda.com/search/part/ATTINY84A-MU/?ref=eda
U$3 U$5 = ayys:6PINEADER

## Net classes
1 USB 1st Layer: width 0.124 mm, clearance 0.102 mm
2 MIPI 100 Ohm: width 0.124 mm, clearance 0.114 mm
3 eDP 4th Layer: width 0.113 mm, clearance 0.203 mm
4 USB 4th Layer: width 0.106 mm, clearance 0.102 mm
5 eDP 1st Layer: width 0.142 mm, clearance 0.203 mm
6 USB 6th Layer: width 0.124 mm, clearance 0.102 mm
7 eDP 6th Layer: width 0.142 mm, clearance 0.203 mm